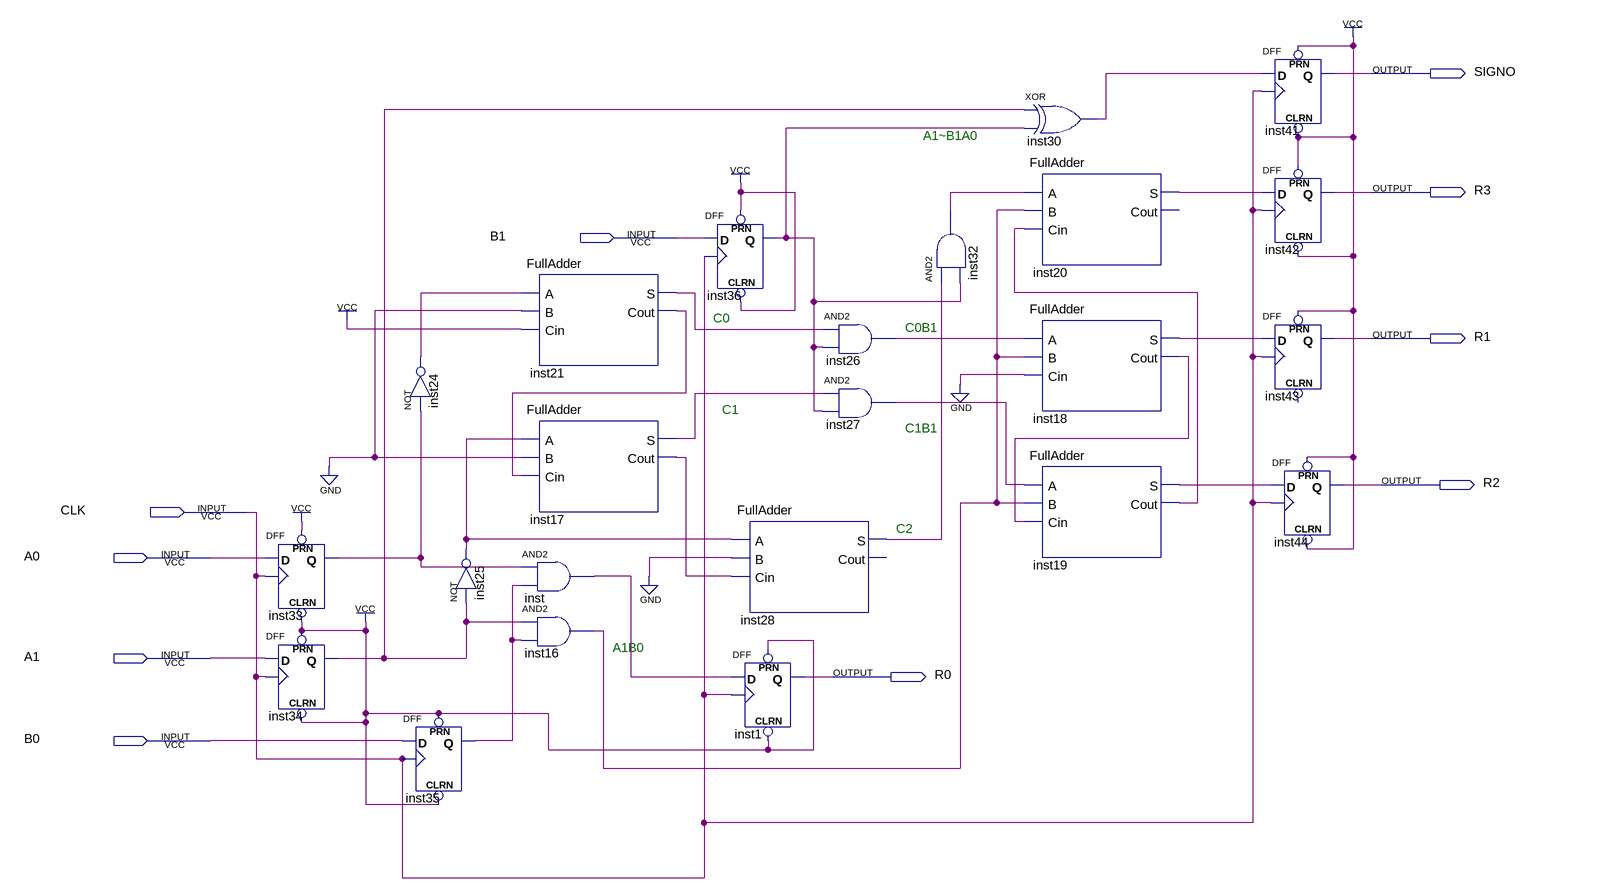
[diagram p0: schematic sheet]
// Quartus schematic MultiplicadorCS.bdf as structural Verilog: 23 symbols, 10 pins
module MultiplicadorCS (
  input  B1,
  input  CLK,
  input  A0,
  input  A1,
  input  B0,
  output SIGNO,
  output R3,
  output R1,
  output R2,
  output R0
);

  wire inst16_out, inst17_cout, inst17_s, inst18_cout, inst18_s, inst19_cout, inst19_s, inst20_s,
       inst21_cout, inst21_s, inst24_out, inst25_out, inst26_out, inst27_out, inst28_s, inst30_out,
       inst32_out, inst33_q, inst34_q, inst35_q, inst36_q, inst_out;

  DFF inst33 (.CLRN(1'b1), .CLK(CLK), .D(A0), .PRN(1'b1), .Q(inst33_q));
  DFF inst34 (.CLRN(1'b1), .CLK(CLK), .D(A1), .PRN(1'b1), .Q(inst34_q));
  not inst24 (inst24_out, inst33_q);
  not inst25 (inst25_out, inst34_q);
  DFF inst35 (.CLRN(1'b1), .CLK(CLK), .D(B0), .PRN(1'b1), .Q(inst35_q));
  FullAdder inst21 (.A(inst24_out), .B(1'b0), .Cin(1'b1), .S(inst21_s), .Cout(inst21_cout));
  FullAdder inst17 (.A(inst25_out), .B(1'b0), .Cin(inst21_cout), .S(inst17_s), .Cout(inst17_cout));
  and inst (inst_out, inst33_q, inst35_q);
  and inst16 (inst16_out, inst34_q, inst35_q);
  DFF inst36 (.CLRN(1'b1), .CLK(CLK), .D(B1), .PRN(1'b1), .Q(inst36_q));
  FullAdder inst28 (.A(inst25_out), .B(1'b0), .Cin(inst17_cout), .S(inst28_s));  // open: Cout
  DFF inst1 (.CLRN(1'b1), .CLK(CLK), .D(inst_out), .PRN(1'b1), .Q(R0));
  and inst26 (inst26_out, inst21_s, inst36_q);
  and inst27 (inst27_out, inst17_s, inst36_q);
  and inst32 (inst32_out, inst28_s, inst36_q);
  xor inst30 (inst30_out, inst34_q, inst36_q);
  FullAdder inst20 (.A(inst32_out), .B(inst16_out), .Cin(inst19_cout), .S(inst20_s));  // open: Cout
  FullAdder inst18 (.A(inst26_out), .B(inst16_out), .Cin(1'b0), .S(inst18_s), .Cout(inst18_cout));
  FullAdder inst19 (.A(inst27_out), .B(inst16_out), .Cin(inst18_cout), .S(inst19_s), .Cout(inst19_cout));
  DFF inst41 (.CLRN(1'b1), .CLK(CLK), .D(inst30_out), .PRN(1'b1), .Q(SIGNO));
  DFF inst42 (.CLRN(1'b1), .CLK(CLK), .D(inst20_s), .PRN(1'b1), .Q(R3));
  DFF inst43 (.CLK(CLK), .D(inst18_s), .PRN(1'b1), .Q(R1));  // open: CLRN
  DFF inst44 (.CLRN(1'b1), .CLK(CLK), .D(inst19_s), .PRN(1'b1), .Q(R2));

  // Notes on the sheet:
  //   A1~B1A0
  //   C0
  //   C0B1
  //   C1
  //   C1B1
  //   C2
  //   A1B0
endmodule
